# Altium schematic sheet schematic EN15.SchDoc
size A; Author: Dojitha Mirihagalla; DrawnBy: Dojitha Mirihagalla; SheetNumber: 1; SheetTotal: 1; SPICEModelCacheLWYSPOIM: <root> / <DocumentId>LWYSPOIM</DocumentId> / <CacheFrame Number="0"> / <Model Name="1n4001" Kind="MDL"> / <Text>*1N4001 MCE 8-16-95 / *50V 1A Si GenPurpose Diode pkg:DIODE0.4 1,2 / .MODEL 1N4001 D(IS=2.55E-9 RS=0.042 N=1.75 TT=5.76E-6 CJO=1.85E-11 / + VJ=0.75 M=0.333 BV=50 IBV=1E-5 )</Text> / </Model> / </CacheFrame> / </root>
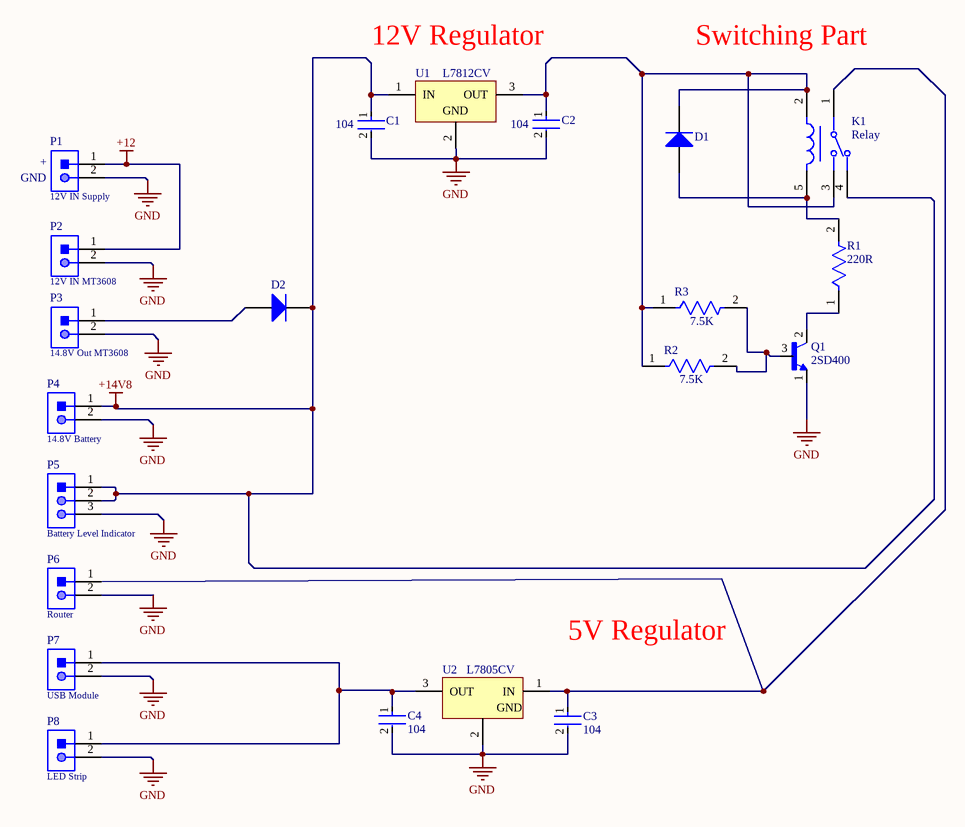
[diagram p0: schematic EN15.SchDoc]

## Parts
C1  104  [FP-RCE0K1-MFG]
C2  104  [FP-RCE0K1-MFG]
C3  104  [FP-RCE0K1-MFG]
C4  104  [FP-RCE0K1-MFG]
D1  Diode 1N4001  [DO-41]  (value not drawn)
D2  Diode 1N4001  [DO-41]  (value not drawn)
K1  Relay  [FP-JS1-5V-F-MFG]
P1  12V IN Supply  [61300211121]
P2  12V IN MT3608  [61300211121]
P3  14.8V Out MT3608  [61300211121]
P4  14.8V Battery  [61300211121]
P5  Battery Level Indicator  [61900319521]
P6  Router  [61300211121]
P7  USB Module  [61300211121]
P8  LED Strip  [61300211121]
Q1  2SD400  [TO145P470X600X850-3P]
R1  Resistance: 220R  [FP-CF14-MFG]  (hidden comment: PCF14JT7K50)
R2  Resistance: 7.5K  [FP-CF14-MFG]  (hidden comment: PCF14JT7K50)
R3  Resistance: 7.5K  [FP-CF14-MFG]  (hidden comment: PCF14JT7K50)
U1  L7812CV  [TO220]
U2  L7805CV  [TO220]

## Nets
+12: P1.1 P2.1
+14V8: C1.1 D2.2(K) K1.4(N.C.) P4.1 P5.1 P5.2 U1.1(IN)
GND: C1.2 C2.2 C3.2 C4.2 P1.2 P2.2 P3.2 P4.2 P5.3 P6.2 P7.2 P8.2 Q1.1(E) U1.2(GND) U2.2(GND)
NetC2_1: C2.1 D1.2(K) K1.2(1_COIL) K1.3(N.O.) R2.1 R3.1 U1.3(OUT)
NetC3_1: C3.1 K1.1(COM) P6.1 U2.1(IN)
NetC4_1: C4.1 P7.1 P8.1 U2.3(OUT)
NetD1_1: D1.1(A) K1.5(2_COIL) R1.2
NetD2_1: D2.1(A) P3.1
NetQ1_2: Q1.2(C) R1.1
NetQ1_3: Q1.3(B) R2.2 R3.2

## Notes on the sheet
- (near U1) 12V Regulator
- Switching Part
- (near P1) +
- (near P1) GND
- 5V Regulator

## Library data of the parts
C1-C4 = CMP-06035-043061-1: Cap Ceramic 1pF 100V C0G ±0.25pF Radial 5mm +125°C Automotive Bulk; Lead Diameter: 0.5mm; Lead/Base Style: Formed Leads; Capacitance: 1pF; Packaging: Tape and Reel; Mount: Through Hole; Min Operating Temperature: -55°C; Length: 0.142inch; Ratings: AEC-Q200; Termination: Radial; Package Quantity: 2000; Height - Seated (Max): 0.138inch; Lead Pitch: 0.197inch; Voltage Rating (DC): 100V; Dielectric: C0G; Resistor Type: Ceramic; Height: 3.5mm; Width: 0.098inch; Voltage Rating: 100V; Max Operating Temperature: 125°C; Case/Package: Radial
D1 D2 = Diode 1N4001: 1 Amp General Purpose Rectifier; Published: 8-Jun-2000; LatestRevisionDate: 17-Jul-2002; LatestRevisionNote: Re-released for DXP Platform.; DatasheetVersion: 1998; PackageVersion: Aug-1999; PackageReference: DO-41; Publisher: Altium Limited; PackageDescription: Diode, Axial; Body 5.2 x 2.7 mm (LxDia. max), Lead Dia. 0.86 mm (max); Code_JEDEC: DO-204-AL; ComponentLink1Description: Manufacturer Link; ComponentLink1URL: http://www.fairchildsemi.com/; ComponentLink2Description: Datasheet; ComponentLink2URL: http://www.fairchildsemi.com/ds/1N%2F1N4001.pdf
K1 = CMP-05606-000016-1: RELAY GEN PURPOSE SPDT 10A 5V; Manufacturer Part Number: JS1-5V-F; Manufacturer: Panasonic; Coil Type: Non-Latching; Number Of Contacts: 1; Standoff Height: 0.3mm; Switching Power: 150W; Coil Power: 360mW; Coil Current: 72mA; Coil Resistance: 69.4Ω; Lead Free: Yes; Device Class L3: Power Relays; Device Class L1: Electromechanical; Ambient Temperature Range High: +70°C; Temperature: -40°C to +70°C; Temperature Range High: +70°C; Temperature Range Low: -40°C; Coil Voltage: 5V; Switching Current: 10A; Digikey Description: RELAY GEN PURPOSE SPDT 10A 5V; Device Class L2: Relays; Ambient Temperature Range Low: -40°C; Throw Configuration: SPDT; Category: Relay; ComponentLink2URL: https://www3.panasonic.biz/ac/e_download/control/relay/power/catalog/mech_eng_js.pdf?via=ok; Package: JS1-5V-F; Octopart: https://octopart.com/js1-5v-f-panasonic-39428621; Mouser Description: JS Series 10 A SPDT 5 V Through Hole Sealed Miniature Non-Polarized Power Relay; Height: 16.8mm; ComponentLink2Description: Datasheet; RoHS: TRUE; Automotive: No
P1-P4 P6-P8 = CMP-1712-00002-4: THT Vertical Pin Header WR-PHD, Pitch 2.54 mm, Single Row, 2 pins; Manufacturer: Wurth Elektronik; Rated Current: 3A; Gender: Male; Withstanding Voltage: 500VAC; Working Voltage: 250VAC; Pitch: 2.54mm; Contact Resistance: 20mOhm; Pin Number: 2; Mounting Technology: THT; Orientation: Vertical; Operating Temperature: -40to105degC; Packaging: Bag; Publisher: WurthElektronik; Datasheet URL: https://katalog.we-online.de/em/datasheet/6130xx11121.pdf; Manufacturer URL: http://www.we-online.de; Row Number: Single; Package Reference: 61300211121; Part Number: 61300211121
P5 = CMP-1502-00600-1: Male Top Locking Header WR-WTB, THT, Right Angled, pitch 2.54 mm, 1 x 3 position; Manufacturer: Wurth Elektronik; Working Voltage: 250VAC; Pitch: 2.54mm; Position: 1x3; Contact Resistance: 20mOhm; Package Reference: 61900319521; Manufacturer URL: http://www.we-online.de; Orientation: RightAngled; Operating Temperature: -40to105degC; Publisher: WurthElektronik; Packaging: Bag; Datasheet URL: https://katalog.we-online.de/em/datasheet/6190xx19521.pdf; Gender: Male; Mounting Technology: THT; Part Number: 61900319521
Q1 = 2SD400: Connector Header Through Hole 20 position 0.100 _2.54mm_; MF: Samtec Inc.; Package: None; Price: None; Value: *; SnapEDA_Link: https://www.snapeda.com/parts/2SD400/Samtec%20Inc./view-part/627662/?ref=snap; Availability: Unavailable; MP: 2SD400
R1-R3 = CMP-26528-000003-1: RES 7.5K OHM 1/4W 5% AXIAL; Max Power Dissipation: 250mW; Temperature Coefficient: -400ppm/°C; RoHS Compliant: Yes; Lead Free: Lead Free; Max Operating Temperature: 155°C; Case/Package: Axial; Tolerance: 5%; Power Rating: 250mW; Diameter: 2.3mm; Features: Flame Retardant Coating; Series: CF; Resistor Type: Carbon Film; Number of Terminations: 2; Length: 0.256inch; Min Operating Temperature: -55°C; Contact Plating: Tin; Packaging: Tape and Reel; Mount: Through Hole; Radiation Hardening: No
U1 = CMP-0244-00450-1: Positive Voltage Regulator, 12V, 3-Pin TO-220; PackageDescription: TO, Thru-Hole, Vertical, Heatsink Mounted; 3 In-Line Leads; Pitch 2.54 mm; ComponentLink3URL: http://www.st.com/internet/com/TECHNICAL_RESOURCES/TECHNICAL_LITERATURE/PACKAGE_INFORMATION/CD00004649.pdf; ComponentLink1URL: http://www.st.com; ComponentLink2Description: Datasheet; ComponentLink3Description: Package Specification; ComponentLink2URL: http://www.st.com/internet/com/TECHNICAL_RESOURCES/TECHNICAL_LITERATURE/DATASHEET/CD00000444.pdf; DatasheetVersion: 16/11/2011; PackageVersion: ver3.0; PackageReference: TO220; ComponentLink1Description: Manufacturer URL
U2 = CMP-0244-00483-1: Positive Voltage Regulator, 5V, 3-Pin TO-220; PackageDescription: TO, Thru-Hole, Vertical, Heatsink Mounted; 3 In-Line Leads; Pitch 2.54 mm; ComponentLink2Description: Datasheet; PackageReference: TO220; ComponentLink3URL: http://www.st.com/internet/com/TECHNICAL_RESOURCES/TECHNICAL_LITERATURE/PACKAGE_INFORMATION/CD00004649.pdf; DatasheetVersion: 16/11/2011; ComponentLink1Description: Manufacturer URL; ComponentLink1URL: http://www.st.com; PackageVersion: ver3.0; ComponentLink3Description: Package Specification; ComponentLink2URL: http://www.st.com/internet/com/TECHNICAL_RESOURCES/TECHNICAL_LITERATURE/DATASHEET/CD00000444.pdf